# Altium schematic sheet BSPD_mod_0513.SchDoc (part 2 of 3)
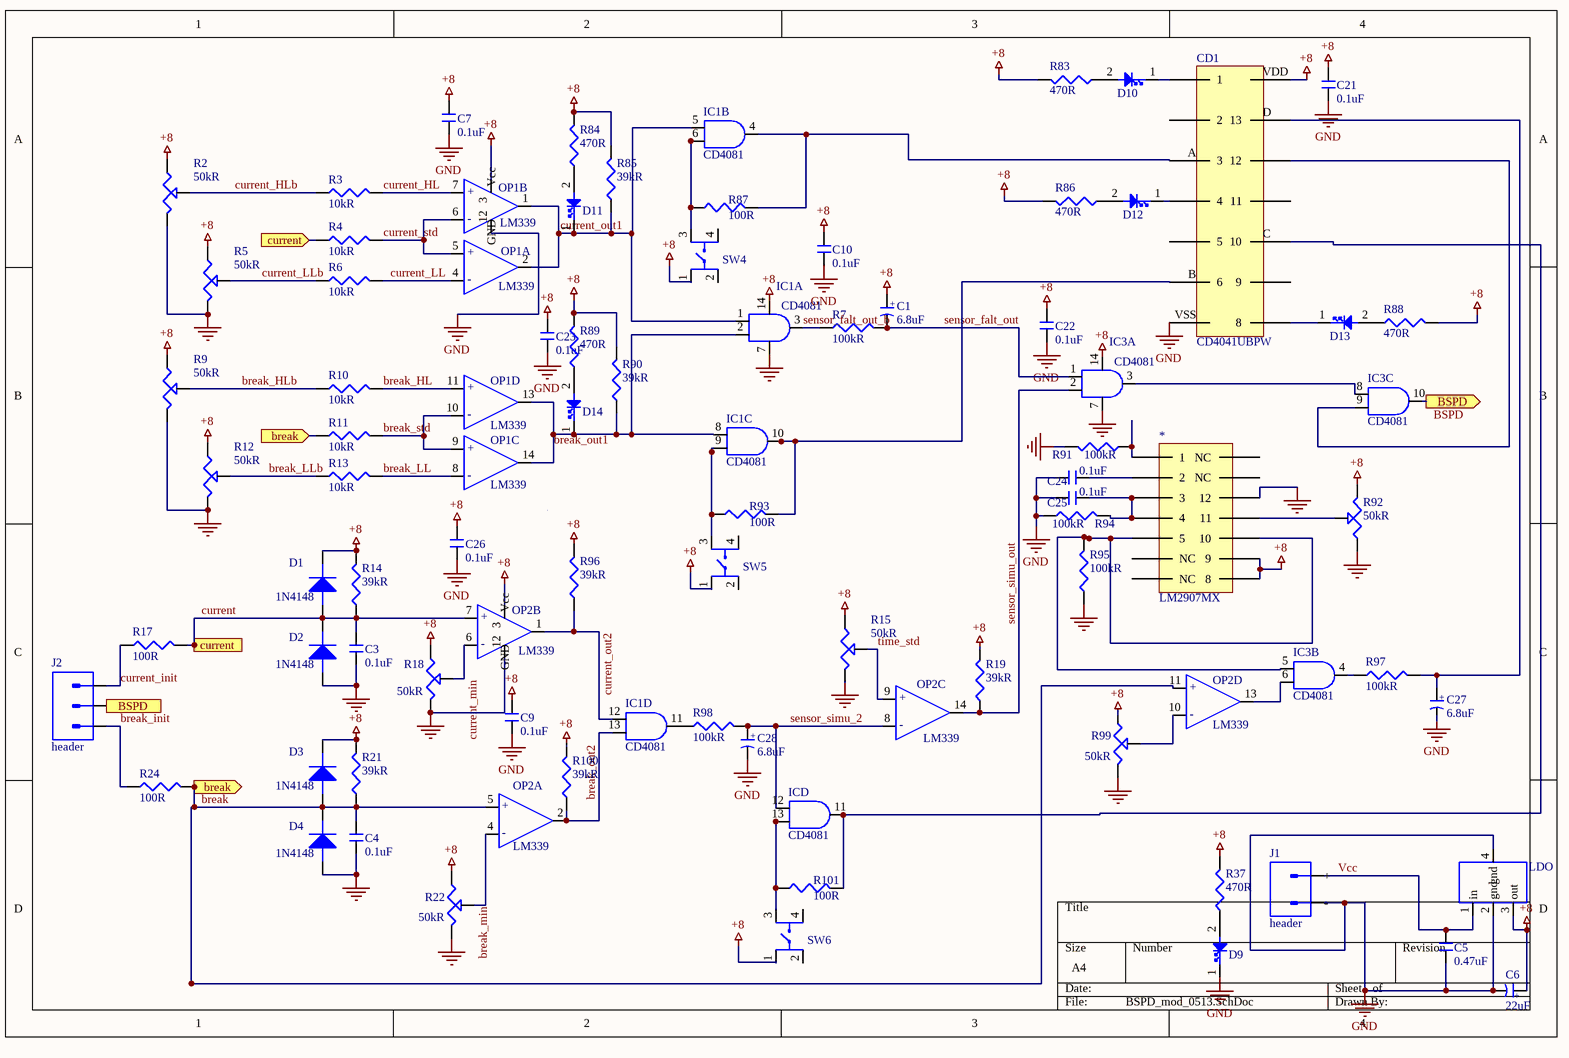
[diagram p1: BSPD_mod_0513.SchDoc]
## Library data of the parts
* = LM2907MX: FVC 14-Pin SOIC T/R; Manufacturer: TI National Semiconductor; Max Supply Voltage: 28V; Min Supply Voltage: 12V; Supplier 1: Digi-Key; Supplier Part Number 1: LM2907MXCT-ND; Manufacturer Part Number: LM2907MX; RoHS: No; Pricing 1: 1 = 2.84000 (USD); Case/Package: SOIC; Number of Pins: 14; Min Operating Temperature: -40°C; Max Operating Temperature: 85°C; Packaging: Tape and Reel; Package Quantity: 1; Radiation Hardening: No; Lead Free: Contains Lead; ComponentLink1URL: https://datasheet.ciiva.com/26887/lm2907mx-26887521.pdf?src-supplier=IIIC; ComponentLink1Description: https://datasheet.ciiva.com/26887/lm2907mx-26887521.pdf?src-supplier=IIIC; ComponentLink2URL: https://datasheet.ciiva.com/6598/lm2907-n-6598237.pdf?src-supplier=Digi-Key; ComponentLink2Description: https://datasheet.ciiva.com/6598/lm2907-n-6598237.pdf?src-supplier=Digi-Key; ComponentLink3URL: https://datasheet.ciiva.com/6598/lm2907-n-6598238.pdf?src-supplier=Digi-Key; ComponentLink3Description: https://datasheet.ciiva.com/6598/lm2907-n-6598238.pdf?src-supplier=Digi-Key; ComponentLink4URL: https://datasheet.ciiva.com/6598/lm2907-n-6598239.pdf?src-supplier=Digi-Key; ComponentLink4Description: https://datasheet.ciiva.com/6598/lm2907-n-6598239.pdf?src-supplier=Digi-Key
C1 C27 C28 = 6.8uF-TAJC685K050RNJ: Cap Tant Solid 6.8uF 50V C CASE 10% (6 X 3.2 X 2.6mm) Inward L SMD 6032-28 1 Ohm 125C T/R; Manufacturer: AVX; Dielectric Material: Tantalum; ESR (Equivalent Series Resistance): 1R; Leakage Current: 3.4uA; Polarity: Polar; Dissipation Factor: 6%; Supplier 1: Mouser; Supplier Part Number 1: 581-TAJC685K050RNJ; Manufacturer Part Number: TAJC685K050RNJ; Stock 1: 13768; Pricing 1: 1 = 1.27000, 10 = 0.96300, 100 = 0.75300, 500 = 0.49500, 1000 = 0.43600, 2500 = 0.42200 (USD); Mount: Surface Mount; Case/Package: Molded; Weight: 0.005291oz; Case Code (Metric): 6032; Case Code (Imperial): 2312; Min Operating Temperature: -55°C; Max Operating Temperature: 125°C; Capacitance: 6.8uF; Tolerance: 10%; Voltage Rating: 50V; Packaging: Tape and Reel; Package Quantity: 1; Termination: SMD/SMT; Voltage Rating (DC): 50V; Features: General Purpose; Length: 6mm; Height: 2.8mm; Width: 0.126inch; Height - Seated (Max): 0.11inch; Depth: 3.2mm; Radiation Hardening: No; REACH SVHC: No SVHC; Lead Free: Lead Free; ComponentLink1URL: https://datasheet.ciiva.com/267/taj-267945.pdf?src-supplier=Digi-Key; ComponentLink1Description: https://datasheet.ciiva.com/267/taj-267945.pdf?src-supplier=Digi-Key; ComponentLink2URL: https://datasheet.ciiva.com/267/taj-267946.pdf?src-supplier=Digi-Key; ComponentLink2Description: https://datasheet.ciiva.com/267/taj-267946.pdf?src-supplier=Digi-Key; ComponentLink3URL: https://datasheet.ciiva.com/267/taj-267947.pdf?src-supplier=Digi-Key; ComponentLink3Description: https://datasheet.ciiva.com/267/taj-267947.pdf?src-supplier=Digi-Key; ComponentLink4URL: https://datasheet.ciiva.com/12910/taj-27497-12910591.pdf?src-supplier=Mouser; ComponentLink4Description: https://datasheet.ciiva.com/12910/taj-27497-12910591.pdf?src-supplier=Mouser; ComponentLink5URL: https://datasheet.ciiva.com/17338/taj-17338791.pdf?src-supplier=Avnet+Europe; ComponentLink5Description: https://datasheet.ciiva.com/17338/taj-17338791.pdf?src-supplier=Avnet+Europe; ComponentLink6URL: http://datasheet.octopart.com/TAJC685K050RNJ-AVX-datasheet-50868559.pdf?src-supplier=AVX; ComponentLink6Description: http://datasheet.octopart.com/TAJC685K050RNJ-AVX-datasheet-50868559.pdf?src-supplier=AVX; ComponentLink7URL: http://datasheet.octopart.com/TAJC685K050RNJ-AVX-datasheet-5313859.pdf?src-supplier=Element14; ComponentLink7Description: http://datasheet.octopart.com/TAJC685K050RNJ-AVX-datasheet-5313859.pdf?src-supplier=Element14; ComponentLink8URL: http://datasheet.octopart.com/TAJC685K050RNJ-AVX-datasheet-78694144.pdf?src-supplier=Element14; ComponentLink8Description: http://datasheet.octopart.com/TAJC685K050RNJ-AVX-datasheet-78694144.pdf?src-supplier=Element14; ComponentLink9URL: http://datasheet.octopart.com/TAJC685K050RNJ-AVX-Interconnect---Elco-datasheet-8359467.pdf; ComponentLink9Description: http://datasheet.octopart.com/TAJC685K050RNJ-AVX-Interconnect---Elco-datasheet-8359467.pdf; ComponentLink10URL: http://datasheet.octopart.com/TAJC685K050RNJ-AVX-Interconnect---Elco-datasheet-8398506.pdf; ComponentLink10Description: http://datasheet.octopart.com/TAJC685K050RNJ-AVX-Interconnect---Elco-datasheet-8398506.pdf; ComponentLink11URL: http://datasheet.octopart.com/TAJC685K050RNJ-AVX-Interconnect---Elco-datasheet-12511273.pdf; ComponentLink11Description: http://datasheet.octopart.com/TAJC685K050RNJ-AVX-Interconnect---Elco-datasheet-12511273.pdf; ComponentLink12URL: http://datasheet.octopart.com/TAJC685K050RNJ-AVX-Interconnect---Elco-datasheet-5308206.pdf?src-supplier=Factory+Futures; ComponentLink12Description: http://datasheet.octopart.com/TAJC685K050RNJ-AVX-Interconnect---Elco-datasheet-5308206.pdf?src-supplier=Factory+Futures; ComponentLink13URL: http://datasheet.octopart.com/TAJC685K050RNJ-AVX-Interconnect---Elco-datasheet-5393561.pdf?src-supplier=Factory+Futures; ComponentLink13Description: http://datasheet.octopart.com/TAJC685K050RNJ-AVX-Interconnect---Elco-datasheet-5393561.pdf?src-supplier=Factory+Futures; ComponentLink14URL: http://datasheet.octopart.com/TAJC685K050RNJ-AVX-Interconnect---Elco-datasheet-5428838.pdf?src-supplier=Factory+Futures; ComponentLink14Description: http://datasheet.octopart.com/TAJC685K050RNJ-AVX-Interconnect---Elco-datasheet-5428838.pdf?src-supplier=Factory+Futures; ComponentLink15URL: http://datasheet.octopart.com/TAJC685K050RNJ-AVX-Interconnect---Elco-datasheet-8324253.pdf?src-supplier=Factory+Futures; ComponentLink15Description: http://datasheet.octopart.com/TAJC685K050RNJ-AVX-Interconnect---Elco-datasheet-8324253.pdf?src-supplier=Factory+Futures; ComponentLink16URL: http://datasheet.octopart.com/TAJC685K050RNJ-AVX-Interconnect---Elco-datasheet-8447299.pdf?src-supplier=Factory+Futures; ComponentLink16Description: http://datasheet.octopart.com/TAJC685K050RNJ-AVX-Interconnect---Elco-datasheet-8447299.pdf?src-supplier=Factory+Futures; ComponentLink17URL: http://datasheet.octopart.com/TAJC685K050RNJ-AVX-Interconnect---Elco-datasheet-8621976.pdf?src-supplier=Factory+Futures; ComponentLink17Description: http://datasheet.octopart.com/TAJC685K050RNJ-AVX-Interconnect---Elco-datasheet-8621976.pdf?src-supplier=Factory+Futures; ComponentLink18URL: http://datasheet.octopart.com/TAJC685K050RNJ-AVX-Interconnect---Elco-datasheet-8701730.pdf?src-supplier=Factory+Futures; ComponentLink18Description: http://datasheet.octopart.com/TAJC685K050RNJ-AVX-Interconnect---Elco-datasheet-8701730.pdf?src-supplier=Factory+Futures; ComponentLink19URL: http://datasheet.octopart.com/TAJC685K050RNJ-AVX-Interconnect---Elco-datasheet-8715220.pdf?src-supplier=Factory+Futures; ComponentLink19Description: http://datasheet.octopart.com/TAJC685K050RNJ-AVX-Interconnect---Elco-datasheet-8715220.pdf?src-supplier=Factory+Futures; ComponentLink20URL: http://datasheet.octopart.com/TAJC685K050RNJ-AVX-Interconnect---Elco-datasheet-8836325.pdf?src-supplier=Factory+Futures; ComponentLink20Description: http://datasheet.octopart.com/TAJC685K050RNJ-AVX-Interconnect---Elco-datasheet-8836325.pdf?src-supplier=Factory+Futures; ComponentLink21URL: http://datasheet.octopart.com/TAJC685K050RNJ-AVX-Interconnect---Elco-datasheet-8853265.pdf?src-supplier=Factory+Futures; ComponentLink21Description: http://datasheet.octopart.com/TAJC685K050RNJ-AVX-Interconnect---Elco-datasheet-8853265.pdf?src-supplier=Factory+Futures; ComponentLink22URL: http://datasheet.octopart.com/TAJC685K050RNJ-AVX-Interconnect---Elco-datasheet-8858887.pdf?src-supplier=Factory+Futures; ComponentLink22Description: http://datasheet.octopart.com/TAJC685K050RNJ-AVX-Interconnect---Elco-datasheet-8858887.pdf?src-supplier=Factory+Futures; ComponentLink23URL: http://datasheet.octopart.com/TAJC685K050RNJ-AVX-Interconnect---Elco-datasheet-8877386.pdf?src-supplier=Factory+Futures; ComponentLink23Description: http://datasheet.octopart.com/TAJC685K050RNJ-AVX-Interconnect---Elco-datasheet-8877386.pdf?src-supplier=Factory+Futures; ComponentLink24URL: http://datasheet.octopart.com/TAJC685K050RNJ-AVX-Interconnect---Elco-datasheet-10028080.pdf?src-supplier=Factory+Futures; ComponentLink24Description: http://datasheet.octopart.com/TAJC685K050RNJ-AVX-Interconnect---Elco-datasheet-10028080.pdf?src-supplier=Factory+Futures; ComponentLink25URL: http://datasheet.octopart.com/TAJC685K050RNJ-AVX-Interconnect---Elco-datasheet-10193294.pdf?src-supplier=Factory+Futures; ComponentLink25Description: http://datasheet.octopart.com/TAJC685K050RNJ-AVX-Interconnect---Elco-datasheet-10193294.pdf?src-supplier=Factory+Futures; ComponentLink26URL: http://datasheet.octopart.com/TAJC685K050RNJ-AVX-Interconnect---Elco-datasheet-10285639.pdf?src-supplier=Factory+Futures; ComponentLink26Description: http://datasheet.octopart.com/TAJC685K050RNJ-AVX-Interconnect---Elco-datasheet-10285639.pdf?src-supplier=Factory+Futures; ComponentLink27URL: http://datasheet.octopart.com/TAJC685K050RNJ-AVX-Interconnect---Elco-datasheet-10380087.pdf?src-supplier=Factory+Futures; ComponentLink27Description: http://datasheet.octopart.com/TAJC685K050RNJ-AVX-Interconnect---Elco-datasheet-10380087.pdf?src-supplier=Factory+Futures; ComponentLink28URL: http://datasheet.octopart.com/TAJC685K050RNJ-AVX-Interconnect---Elco-datasheet-10403705.pdf?src-supplier=Factory+Futures; ComponentLink28Description: http://datasheet.octopart.com/TAJC685K050RNJ-AVX-Interconnect---Elco-datasheet-10403705.pdf?src-supplier=Factory+Futures; ComponentLink29URL: http://datasheet.octopart.com/TAJC685K050RNJ-AVX-Interconnect---Elco-datasheet-10545425.pdf?src-supplier=Factory+Futures; ComponentLink29Description: http://datasheet.octopart.com/TAJC685K050RNJ-AVX-Interconnect---Elco-datasheet-10545425.pdf?src-supplier=Factory+Futures; ComponentLink30URL: http://datasheet.octopart.com/TAJC685K050RNJ-AVX-Interconnect---Elco-datasheet-10620092.pdf?src-supplier=Factory+Futures; ComponentLink30Description: http://datasheet.octopart.com/TAJC685K050RNJ-AVX-Interconnect---Elco-datasheet-10620092.pdf?src-supplier=Factory+Futures; ComponentLink31URL: http://datasheet.octopart.com/TAJC685K050RNJ-AVX-Interconnect---Elco-datasheet-10839255.pdf?src-supplier=Factory+Futures; ComponentLink31Description: http://datasheet.octopart.com/TAJC685K050RNJ-AVX-Interconnect---Elco-datasheet-10839255.pdf?src-supplier=Factory+Futures; ComponentLink32URL: http://datasheet.octopart.com/TAJC685K050RNJ-AVX-Interconnect---Elco-datasheet-10851837.pdf?src-supplier=Factory+Futures; ComponentLink32Description: http://datasheet.octopart.com/TAJC685K050RNJ-AVX-Interconnect---Elco-datasheet-10851837.pdf?src-supplier=Factory+Futures; ComponentLink33URL: http://datasheet.octopart.com/TAJC685K050RNJ-AVX-Interconnect---Elco-datasheet-10916590.pdf?src-supplier=Factory+Futures; ComponentLink33Description: http://datasheet.octopart.com/TAJC685K050RNJ-AVX-Interconnect---Elco-datasheet-10916590.pdf?src-supplier=Factory+Futures; ComponentLink34URL: http://datasheet.octopart.com/TAJC685K050RNJ-AVX-Interconnect---Elco-datasheet-11475269.pdf?src-supplier=Factory+Futures; ComponentLink34Description: http://datasheet.octopart.com/TAJC685K050RNJ-AVX-Interconnect---Elco-datasheet-11475269.pdf?src-supplier=Factory+Futures; ComponentLink35URL: http://datasheet.octopart.com/TAJC685K050RNJ-AVX-datasheet-48507738.pdf?src-supplier=Future+Electronics; ComponentLink35Description: http://datasheet.octopart.com/TAJC685K050RNJ-AVX-datasheet-48507738.pdf?src-supplier=Future+Electronics; ComponentLink36URL: http://datasheet.octopart.com/TAJC685K050RNJ-AVX-datasheet-66442782.pdf?src-supplier=Newark; ComponentLink36Description: http://datasheet.octopart.com/TAJC685K050RNJ-AVX-datasheet-66442782.pdf?src-supplier=Newark; ComponentLink37URL: http://datasheet.octopart.com/TAJC685K050RNJ-AVX-datasheet-62304617.pdf?src-supplier=Farnell; ComponentLink37Description: http://datasheet.octopart.com/TAJC685K050RNJ-AVX-datasheet-62304617.pdf?src-supplier=Farnell; ComponentLink38URL: http://datasheet.octopart.com/TAJ-Series---Standard-Tantalum-AVX-datasheet-family-88.pdf; ComponentLink38Description: http://datasheet.octopart.com/TAJ-Series---Standard-Tantalum-AVX-datasheet-family-88.pdf
C3 C4 C7 C9 C10 C21-C26 = 0.1uF-C0603X104K5RAC3316: Cap Ceramic 0.1uF 50V X7R 10% Pad SMD 0603 Flexible Termination 125C Automotive; Manufacturer: KEMET; Supplier 1: Mouser; Supplier Part Number 1: 80-C0603X104K5R3316; Manufacturer Part Number: C0603X104K5RAC3316; Stock 1: 9731; Pricing 1: 1 = 0.19000, 10 = 0.12700, 100 = 0.06400, 500 = 0.04400, 1000 = 0.03800, 4000 = 0.03700 (USD); ComponentLink1URL: http://datasheet.octopart.com/C0603X104K5RAC3316-KEMET-datasheet-136663908.pdf?src-supplier=Allied+Electronics; ComponentLink1Description: http://datasheet.octopart.com/C0603X104K5RAC3316-KEMET-datasheet-136663908.pdf?src-supplier=Allied+Electronics
C5 = 0.47uF-C0805C474K3REC7210: Cap Cer 0805 470NF 25V X7R 10%; Manufacturer: KEMET; Supplier 1: Mouser; Manufacturer Part Number: C0805C474K3REC7210; Stock 1: 9935; Pricing 1: 1 = 0.30000, 10 = 0.14000, 100 = 0.09000, 500 = 0.08000, 1000 = 0.07000, 2000 = 0.06000 (USD); ComponentLink1URL: https://api.kemet.com/component-edge/download/datasheet/C0805C474K3REC7210.pdf?src-supplier=Digi-Key; ComponentLink1Description: https://api.kemet.com/component-edge/download/datasheet/C0805C474K3REC7210.pdf?src-supplier=Digi-Key; Supplier Part Number 1: 80-C0805C474K3RECLR
C6 = 22uF-GRM21BR61E226ME44L: 0805 22 uF 25 V ±20% Tolerance X5R SMT Multilayer Ceramic Capacitor; Manufacturer: Murata; Voltage Rating: 25V; Supplier 1: Mouser; Manufacturer Part Number: GRM21BR61E226ME44L; Stock 1: 455135; Pricing 1: 1 = 0.49000, 10 = 0.34800, 100 = 0.22900, 250 = 0.22900, 500 = 0.16900, 1000 = 0.14400, 3000 = 0.11800, 6000 = 0.11000, 9000 = 0.10600 (USD); Mount: Surface Mount; Case/Package: 0805; Weight: 0.000335oz; Case Code (Metric): 2012; Case Code (Imperial): 0805; Material: Ceramic; Min Operating Temperature: -55°C; Max Operating Temperature: 85°C; Capacitance: 22uF; Tolerance: 20%; Packaging: Tape and Reel; Dielectric: X5R; Voltage: 25V; Termination: SMD/SMT; Composition: Ceramic; Voltage Rating (DC): 25V; Package Quantity: 3000; Length: 2mm; Height: 1.25mm; Width: 1.25mm; Thickness: 0.057inch; Depth: 1.25mm; REACH SVHC: No SVHC; Lead Free: Lead Free; ComponentLink1URL: https://datasheet.ciiva.com/22787/1747471-22787265.pdf?src-supplier=Farnell; ComponentLink1Description: https://datasheet.ciiva.com/22787/1747471-22787265.pdf?src-supplier=Farnell; ComponentLink2URL: https://datasheet.ciiva.com/7719/1747471-7719095.pdf?src-supplier=Element14; ComponentLink2Description: https://datasheet.ciiva.com/7719/1747471-7719095.pdf?src-supplier=Element14; ComponentLink3URL: https://datasheet.ciiva.com/28584/1747471-28584199.pdf?src-supplier=Element14; ComponentLink3Description: https://datasheet.ciiva.com/28584/1747471-28584199.pdf?src-supplier=Element14; ComponentLink4URL: http://datasheet.octopart.com/GRM21BR61E226ME44L-Murata-datasheet-62317286.pdf?src-supplier=Element14; ComponentLink4Description: http://datasheet.octopart.com/GRM21BR61E226ME44L-Murata-datasheet-62317286.pdf?src-supplier=Element14; ComponentLink5URL: http://datasheet.octopart.com/GRM21BR61E226ME44L-Murata-datasheet-8817987.pdf?src-supplier=Newark; ComponentLink5Description: http://datasheet.octopart.com/GRM21BR61E226ME44L-Murata-datasheet-8817987.pdf?src-supplier=Newark; ComponentLink6URL: http://datasheet.octopart.com/GRM21BR61E226ME44L-Murata-datasheet-14397511.pdf?src-supplier=Future+Electronics; ComponentLink6Description: http://datasheet.octopart.com/GRM21BR61E226ME44L-Murata-datasheet-14397511.pdf?src-supplier=Future+Electronics; ComponentLink7URL: http://datasheet.octopart.com/GRM21BR61E226ME44L-Murata-datasheet-17853151.pdf?src-supplier=Element14; ComponentLink7Description: http://datasheet.octopart.com/GRM21BR61E226ME44L-Murata-datasheet-17853151.pdf?src-supplier=Element14; ComponentLink8URL: http://datasheet.octopart.com/GRM21BR61E226ME44L-Murata-datasheet-22122223.pdf?src-supplier=Future+Electronics; ComponentLink8Description: http://datasheet.octopart.com/GRM21BR61E226ME44L-Murata-datasheet-22122223.pdf?src-supplier=Future+Electronics; ComponentLink9URL: http://datasheet.octopart.com/GRM21BR61E226ME44L-Murata-datasheet-59876780.pdf?src-supplier=TME; ComponentLink9Description: http://datasheet.octopart.com/GRM21BR61E226ME44L-Murata-datasheet-59876780.pdf?src-supplier=TME; ComponentLink10URL: http://datasheet.octopart.com/GRM21BR61E226ME44L-Murata-datasheet-8819587.pdf; ComponentLink10Description: http://datasheet.octopart.com/GRM21BR61E226ME44L-Murata-datasheet-8819587.pdf; ComponentLink11URL: http://datasheet.octopart.com/GRM21BR61E226ME44L-Murata-datasheet-10025737.pdf; ComponentLink11Description: http://datasheet.octopart.com/GRM21BR61E226ME44L-Murata-datasheet-10025737.pdf; ComponentLink12URL: http://datasheet.octopart.com/GRM21BR61E226ME44L-Murata-datasheet-11978611.pdf; ComponentLink12Description: http://datasheet.octopart.com/GRM21BR61E226ME44L-Murata-datasheet-11978611.pdf; ComponentLink13URL: http://datasheet.octopart.com/GRM21BR61E226ME44L-Murata-datasheet-12510076.pdf; ComponentLink13Description: http://datasheet.octopart.com/GRM21BR61E226ME44L-Murata-datasheet-12510076.pdf; ComponentLink14URL: http://datasheet.octopart.com/GRM21BR61E226ME44L-Murata-datasheet-12515295.pdf; ComponentLink14Description: http://datasheet.octopart.com/GRM21BR61E226ME44L-Murata-datasheet-12515295.pdf; Supplier Part Number 1: 81-GRM21BR61E226ME4L
CD1 = CD4041UBPW: Buffer 4-CH Inverting/Non-Inverting Push-Pull CMOS 14-Pin TSSOP Tube; Manufacturer: Texas Instruments; Max Supply Voltage: 18V; Min Supply Voltage: 3V; Propagation Delay: 50ns; Number of Elements: 4; Low Level Output Current: 24mA; Number of Output Lines: 8; Number of Bits per Element: 1; High Level Output Current: -24mA; Quiescent Current: 20uA; Turn-On Delay Time: 120ns; Max Power Dissipation: 100mW; Supplier 1: Digi-Key; Supplier Part Number 1: CD4041UBPW-ND; Manufacturer Part Number: CD4041UBPW; Stock 1: 700; Pricing 1: 1 = 1.29000, 10 = 1.15600, 25 = 1.09760, 100 = 0.90160, 250 = 0.84280, 500 = 0.74480, 1000 = 0.58800, 2500 = 0.54880, 5000 = 0.52136 (USD); Mount: Surface Mount; Case/Package: TSSOP; Number of Pins: 14; Contact Plating: Gold; Min Operating Temperature: -55°C; Max Operating Temperature: 125°C; Packaging: Rail/Tube; Logic Function: Buffer; Package Quantity: 90; Number of Channels: 4; Number of Inputs: 4; Number of Outputs: 4; Number of Input Lines: 4; Polarity: Non-Inverting; Number of Bits: 4; Termination: SMD/SMT; Lead Free: Lead Free; REACH SVHC: No SVHC; ComponentLink1URL: https://datasheet.ciiva.com/1506/1762971-1506275.pdf?src-supplier=Element14; ComponentLink1Description: https://datasheet.ciiva.com/1506/1762971-1506275.pdf?src-supplier=Element14; ComponentLink2URL: https://datasheet.ciiva.com/46618/1836516-46618790.pdf?src-supplier=Newark; ComponentLink2Description: https://datasheet.ciiva.com/46618/1836516-46618790.pdf?src-supplier=Newark; ComponentLink3URL: https://datasheet.ciiva.com/1842/cd4041ub-1842824.pdf?src-supplier=Digi-Key; ComponentLink3Description: https://datasheet.ciiva.com/1842/cd4041ub-1842824.pdf?src-supplier=Digi-Key; ComponentLink4URL: https://octopart.com/click/track?ai=10049&ct=datasheets&sig=04d6427&at=physicalpart&sid=370&ppid=7097409&hlid=29930956&src-supplier=TI+store; ComponentLink4Description: https://octopart.com/click/track?ai=10049&ct=datasheets&sig=04d6427&at=physicalpart&sid=370&ppid=7097409&hlid=29930956&src-supplier=TI+store; ComponentLink5URL: http://datasheet.octopart.com/CD4041UBPW-Texas-Instruments-datasheet-10255163.pdf?src-supplier=Arrow+Electronics; ComponentLink5Description: http://datasheet.octopart.com/CD4041UBPW-Texas-Instruments-datasheet-10255163.pdf?src-supplier=Arrow+Electronics; ComponentLink6URL: http://datasheet.octopart.com/CD4041UBPW-Texas-Instruments-datasheet-27908145.pdf?src-supplier=TI+store; ComponentLink6Description: http://datasheet.octopart.com/CD4041UBPW-Texas-Instruments-datasheet-27908145.pdf?src-supplier=TI+store; ComponentLink7URL: http://datasheet.octopart.com/CD4041UBPW-Texas-Instruments-datasheet-149741.pdf?src-supplier=TI+store; ComponentLink7Description: http://datasheet.octopart.com/CD4041UBPW-Texas-Instruments-datasheet-149741.pdf?src-supplier=TI+store; ComponentLink8URL: http://datasheet.octopart.com/CD4041UBPW-Texas-Instruments-datasheet-10253518.pdf?src-supplier=TI+store; ComponentLink8Description: http://datasheet.octopart.com/CD4041UBPW-Texas-Instruments-datasheet-10253518.pdf?src-supplier=TI+store; ComponentLink9URL: http://sigma.octopart.com/49249819/technical_drawing/Texas-Instruments-CD4041UBPW.pdf?src-supplier=TI+store; ComponentLink9Description: http://sigma.octopart.com/49249819/technical_drawing/Texas-Instruments-CD4041UBPW.pdf?src-supplier=TI+store; ComponentLink10URL: http://datasheet.octopart.com/CD4041UBPW-Texas-Instruments-datasheet-8377696.pdf?src-supplier=Newark; ComponentLink10Description: http://datasheet.octopart.com/CD4041UBPW-Texas-Instruments-datasheet-8377696.pdf?src-supplier=Newark; ComponentLink11URL: http://datasheet.octopart.com/CD4041UBPW-Texas-Instruments-datasheet-654559.pdf?src-supplier=Newark; ComponentLink11Description: http://datasheet.octopart.com/CD4041UBPW-Texas-Instruments-datasheet-654559.pdf?src-supplier=Newark; ComponentLink12URL: http://datasheet.octopart.com/CD4041UBPW-Texas-Instruments-datasheet-8816533.pdf?src-supplier=Newark; ComponentLink12Description: http://datasheet.octopart.com/CD4041UBPW-Texas-Instruments-datasheet-8816533.pdf?src-supplier=Newark; ComponentLink13URL: http://datasheet.octopart.com/CD4041UBPW-Texas-Instruments-datasheet-11538150.pdf?src-supplier=Element14; ComponentLink13Description: http://datasheet.octopart.com/CD4041UBPW-Texas-Instruments-datasheet-11538150.pdf?src-supplier=Element14; ComponentLink14URL: http://datasheet.octopart.com/CD4041UBPW-Texas-Instruments-datasheet-21076600.pdf?src-supplier=Element14; ComponentLink14Description: http://datasheet.octopart.com/CD4041UBPW-Texas-Instruments-datasheet-21076600.pdf?src-supplier=Element14; ComponentLink15URL: http://datasheet.octopart.com/CD4041UBPW-Texas-Instruments-datasheet-47642687.pdf?src-supplier=Newark; ComponentLink15Description: http://datasheet.octopart.com/CD4041UBPW-Texas-Instruments-datasheet-47642687.pdf?src-supplier=Newark; ComponentLink16URL: http://datasheet.octopart.com/CD4041UBPW-Texas-Instruments-datasheet-102487265.pdf?src-supplier=Newark; ComponentLink16Description: http://datasheet.octopart.com/CD4041UBPW-Texas-Instruments-datasheet-102487265.pdf?src-supplier=Newark; Category: buffer
D1-D4 = 1N4148W-TP: 1N4148W Series 100 V 150 mA 4 ns SMT High Speed Switching Diode - SOD-123; Manufacturer: MCC; Max Surge Current: 2A; Forward Voltage: 1V; Forward Current: 150mA; Recovery Time: 4ns; Max Reverse Leakage Current: 5uA; Max Repetitive Reverse Voltage (Vrrm): 100V; Power Dissipation: 400mW; Max Forward Surge Current (Ifsm): 1A; Element Configuration: Single; Polarity: Standard; Capacitance: 4pF; Supplier 1: Digi-Key; Supplier Part Number 1: 1N4148WTPMSCT-ND; Manufacturer Part Number: 1N4148W-TP; Stock 1: 726390; Pricing 1: 1 = 0.10000, 10 = 0.08100, 100 = 0.03400, 500 = 0.02670, 1000 = 0.01854 (USD); Mount: Surface Mount; Number of Pins: 2; Min Operating Temperature: -65°C; Max Operating Temperature: 150°C; Packaging: Tape and Reel; Package Quantity: 3000; Average Rectified Current: 150mA; Reverse Recovery Time: 4ns; Peak Non-Repetitive Surge Current: 2A; Voltage Rating (DC): 100V; Current Rating: 150mA; Output Current: 150mA; Max Reverse Voltage (DC): 100V; Length: 2.85mm; Height: 1.2mm; Width: 1.8mm; Radiation Hardening: No; REACH SVHC: Unknown; Lead Free: Lead Free; ComponentLink1URL: https://datasheet.ciiva.com/1243/1684829-1243908.pdf?src-supplier=Newark; ComponentLink1Description: https://datasheet.ciiva.com/1243/1684829-1243908.pdf?src-supplier=Newark; ComponentLink2URL: https://datasheet.ciiva.com/16836/1n4148wsod123-16836277.pdf?src-supplier=Future+Electronics; ComponentLink2Description: https://datasheet.ciiva.com/16836/1n4148wsod123-16836277.pdf?src-supplier=Future+Electronics; ComponentLink3URL: https://datasheet.ciiva.com/4435/1n4148wsod123-48460-4435223.pdf?src-supplier=Mouser; ComponentLink3Description: https://datasheet.ciiva.com/4435/1n4148wsod123-48460-4435223.pdf?src-supplier=Mouser; ComponentLink4URL: https://datasheet.ciiva.com/14557/70055519-14557767.pdf?src-supplier=Allied+Electronics; ComponentLink4Description: https://datasheet.ciiva.com/14557/70055519-14557767.pdf?src-supplier=Allied+Electronics; ComponentLink5URL: https://datasheet.ciiva.com/911/1n4148wsod123-911676.pdf?src-supplier=Digi-Key; ComponentLink5Description: https://datasheet.ciiva.com/911/1n4148wsod123-911676.pdf?src-supplier=Digi-Key; ComponentLink6URL: https://datasheet.ciiva.com/7622/1684829-7622556.pdf?src-supplier=Element14; ComponentLink6Description: https://datasheet.ciiva.com/7622/1684829-7622556.pdf?src-supplier=Element14; ComponentLink7URL: https://datasheet.ciiva.com/911/1n4148wsod123-911677.pdf?src-supplier=Digi-Key; ComponentLink7Description: https://datasheet.ciiva.com/911/1n4148wsod123-911677.pdf?src-supplier=Digi-Key; ComponentLink8URL: https://datasheet.ciiva.com/911/1n4148wsod123-911678.pdf?src-supplier=Digi-Key; ComponentLink8Description: https://datasheet.ciiva.com/911/1n4148wsod123-911678.pdf?src-supplier=Digi-Key; ComponentLink9URL: https://datasheet.ciiva.com/22747/1684829-22747439.pdf?src-supplier=Element14; ComponentLink9Description: https://datasheet.ciiva.com/22747/1684829-22747439.pdf?src-supplier=Element14; ComponentLink10URL: http://datasheet.octopart.com/1N4148W-TP-Micro-Commercial-datasheet-60845.pdf?src-supplier=Element14; ComponentLink10Description: http://datasheet.octopart.com/1N4148W-TP-Micro-Commercial-datasheet-60845.pdf?src-supplier=Element14; ComponentLink11URL: http://datasheet.octopart.com/1N4148W-TP-MCC-datasheet-8327246.pdf?src-supplier=Future+Electronics; ComponentLink11Description: http://datasheet.octopart.com/1N4148W-TP-MCC-datasheet-8327246.pdf?src-supplier=Future+Electronics; ComponentLink12URL: http://datasheet.octopart.com/1N4148W-TP-MCC-datasheet-124568.pdf?src-supplier=Future+Electronics; ComponentLink12Description: http://datasheet.octopart.com/1N4148W-TP-MCC-datasheet-124568.pdf?src-supplier=Future+Electronics; ComponentLink13URL: http://datasheet.octopart.com/1N4148W-TP-MCC-datasheet-10003094.pdf?src-supplier=Allied+Electronics; ComponentLink13Description: http://datasheet.octopart.com/1N4148W-TP-MCC-datasheet-10003094.pdf?src-supplier=Allied+Electronics; ComponentLink14URL: http://datasheet.octopart.com/1N4148W-TP-Micro-Commercial-datasheet-11773887.pdf?src-supplier=Arrow; ComponentLink14Description: http://datasheet.octopart.com/1N4148W-TP-Micro-Commercial-datasheet-11773887.pdf?src-supplier=Arrow; ComponentLink15URL: http://datasheet.octopart.com/1N4148W-TP-Micro-Commercial-datasheet-13551187.pdf?src-supplier=Future+Electronics; ComponentLink15Description: http://datasheet.octopart.com/1N4148W-TP-Micro-Commercial-datasheet-13551187.pdf?src-supplier=Future+Electronics; ComponentLink16URL: http://datasheet.octopart.com/1N4148W-TP-MCC-datasheet-133511570.pdf?src-supplier=Future+Electronics; ComponentLink16Description: http://datasheet.octopart.com/1N4148W-TP-MCC-datasheet-133511570.pdf?src-supplier=Future+Electronics; ComponentLink17URL: http://datasheet.octopart.com/1N4148W-TP-MCC-datasheet-134792309.pdf?src-supplier=TME; ComponentLink17Description: http://datasheet.octopart.com/1N4148W-TP-MCC-datasheet-134792309.pdf?src-supplier=TME; Supplier 2: Mouser; Supplier Part Number 2: 833-1N4148W-TP
D9-D14 = led-150080RS75000: On a Reel of 4000, 2 V Red LED 2012 (0805) SMD, Wurth Elektronik WL-SMCW 150080RS75000; Manufacturer: Würth Elektronik; Luminous Intensity: 150mcd; Viewing Angle: 140°; Forward Voltage: 2V; Wavelength: 625nm; Lens Style: Clear; Forward Current: 30mA; Test Current: 20mA; Supplier 1: Mouser; Supplier Part Number 1: 710-150080RS75000; Manufacturer Part Number: 150080RS75000; Stock 1: 24117; Pricing 1: 1 = 0.18000, 10 = 0.17500, 25 = 0.17400, 50 = 0.16200, 100 = 0.13900, 250 = 0.12300 (USD); Mount: Surface Mount; Case/Package: 0805; Color: Red; Case Code (Metric): 2012; Case Code (Imperial): 0805; Min Operating Temperature: -40°C; Max Operating Temperature: 85°C; Package Quantity: 4000; Packaging: Tape and Reel; Dominant Wavelength: 625nm; Length: 2mm; Height: 0.7mm; Width: 1.25mm; REACH SVHC: Unknown; ComponentLink1URL: https://datasheet.ciiva.com/22656/150080rs75000-22656961.pdf?src-supplier=Element14; ComponentLink1Description: https://datasheet.ciiva.com/22656/150080rs75000-22656961.pdf?src-supplier=Element14; ComponentLink2URL: https://datasheet.ciiva.com/29279/759435-da-01-en-chipled-0805-w-kl-rot-150080rs75000-29279032.pdf?src-supplier=Conrad; ComponentLink2Description: https://datasheet.ciiva.com/29279/759435-da-01-en-chipled-0805-w-kl-rot-150080rs75000-29279032.pdf?src-supplier=Conrad; ComponentLink3URL: http://datasheet.octopart.com/150080RS75000-W%C3%BCrth-Elektronik-datasheet-15983792.pdf?src-supplier=Element14; ComponentLink3Description: http://datasheet.octopart.com/150080RS75000-W%C3%BCrth-Elektronik-datasheet-15983792.pdf?src-supplier=Element14; ComponentLink4URL: http://datasheet.octopart.com/150080RS75000-W%C3%BCrth-Elektronik-datasheet-41196443.pdf?src-supplier=Newark; ComponentLink4Description: http://datasheet.octopart.com/150080RS75000-W%C3%BCrth-Elektronik-datasheet-41196443.pdf?src-supplier=Newark
IC IC1 IC3 = CD4081BM: In a Tube of 50, Texas Instruments CD4081BM, Quad 2-Input AND Logic Gate, 14-Pin SOIC; Min Supply Voltage: 3V; Max Supply Voltage: 18V; Number of Elements: 4; Number of Outputs: 1; Quiescent Current: 5uA; High Level Output Current: -4.2mA; Low Level Output Current: 4.2mA; Output Current: 6.8mA; Number of Inputs: 2; Propagation Delay: 90ns; Turn-On Delay Time: 12ns; Schmitt Trigger Input: No; Input Capacitance: 5pF; Power Dissipation: 500mW; Supplier 1: Mouser; Supplier Part Number 1: 595-CD4081BM; Manufacturer: Texas Instruments; Manufacturer Part Number: CD4081BM; Stock 1: 2050; Pricing 1: 1 = 0.52000, 10 = 0.43300, 100 = 0.26300, 1000 = 0.20300, 2500 = 0.17300, 10000 = 0.16100 (USD); Mount: Surface Mount; Case/Package: SOIC; Number of Pins: 14; Weight: 0.004564oz; Contact Plating: Gold; Min Operating Temperature: -55°C; Max Operating Temperature: 125°C; Logic Function: AND; Packaging: Rail/Tube; Package Quantity: 50; Number of Gates: 4; Number of Circuits: 4; Number of Input Lines: 2; Number of Output Lines: 1; Number of Bits: 4; Length: 8.65mm; Height: 1.58mm; Width: 3.91mm; Radiation Hardening: No; Lead Free: Lead Free; REACH SVHC: No SVHC; ComponentLink1URL: https://datasheet.ciiva.com/1626/cd4081b-1626210.pdf?src-supplier=Newark; ComponentLink1Description: https://datasheet.ciiva.com/1626/cd4081b-1626210.pdf?src-supplier=Newark; ComponentLink2URL: https://datasheet.ciiva.com/15090/getdatasheetpartid-83085-15090610.pdf?src-supplier=Verical; ComponentLink2Description: https://datasheet.ciiva.com/15090/getdatasheetpartid-83085-15090610.pdf?src-supplier=Verical; ComponentLink3URL: https://datasheet.ciiva.com/26865/cd4081bm-26865364.pdf?src-supplier=IIIC; ComponentLink3Description: https://datasheet.ciiva.com/26865/cd4081bm-26865364.pdf?src-supplier=IIIC; ComponentLink4URL: https://datasheet.ciiva.com/41455/001015529-da-01-en-ic-2-in-and-gate-qu-cd4081bm-soic-14-tid-41455446.pdf?src-supplier=Conrad; ComponentLink4Description: https://datasheet.ciiva.com/41455/001015529-da-01-en-ic-2-in-and-gate-qu-cd4081bm-soic-14-tid-41455446.pdf?src-supplier=Conrad; ComponentLink5URL: https://datasheet.ciiva.com/1866/cd4073b-1866564.pdf?src-supplier=Digi-Key; ComponentLink5Description: https://datasheet.ciiva.com/1866/cd4073b-1866564.pdf?src-supplier=Digi-Key; ComponentLink6URL: https://datasheet.ciiva.com/7949/1833366-7949020.pdf?src-supplier=Element14; ComponentLink6Description: https://datasheet.ciiva.com/7949/1833366-7949020.pdf?src-supplier=Element14; ComponentLink7URL: https://octopart.com/click/track?ai=8629&ct=datasheets&sig=02680e7&at=physicalpart&sid=370&ppid=42573&hlid=24875867&src-supplier=TI+store; ComponentLink7Description: https://octopart.com/click/track?ai=8629&ct=datasheets&sig=02680e7&at=physicalpart&sid=370&ppid=42573&hlid=24875867&src-supplier=TI+store; ComponentLink8URL: http://datasheet.octopart.com/CD4081BM-Texas-Instruments-datasheet-151253.pdf?src-supplier=TI+store; ComponentLink8Description: http://datasheet.octopart.com/CD4081BM-Texas-Instruments-datasheet-151253.pdf?src-supplier=TI+store; ComponentLink9URL: http://datasheet.octopart.com/CD4081BM-Texas-Instruments-datasheet-10253518.pdf?src-supplier=TI+store; ComponentLink9Description: http://datasheet.octopart.com/CD4081BM-Texas-Instruments-datasheet-10253518.pdf?src-supplier=TI+store; ComponentLink10URL: http://datasheet.octopart.com/CD4081BM-Texas-Instruments-datasheet-10253444.pdf?src-supplier=TI+store; ComponentLink10Description: http://datasheet.octopart.com/CD4081BM-Texas-Instruments-datasheet-10253444.pdf?src-supplier=TI+store; ComponentLink11URL: http://datasheet.octopart.com/CD4081BM-Texas-Instruments-datasheet-10794629.pdf?src-supplier=TI+store; ComponentLink11Description: http://datasheet.octopart.com/CD4081BM-Texas-Instruments-datasheet-10794629.pdf?src-supplier=TI+store; ComponentLink12URL: http://sigma.octopart.com/49249646/technical_drawing/Texas-Instruments-CD4081BM.pdf?src-supplier=TI+store; ComponentLink12Description: http://sigma.octopart.com/49249646/technical_drawing/Texas-Instruments-CD4081BM.pdf?src-supplier=TI+store; ComponentLink13URL: http://datasheet.octopart.com/CD4081BM-Texas-Instruments-datasheet-47642733.pdf?src-supplier=Farnell; ComponentLink13Description: http://datasheet.octopart.com/CD4081BM-Texas-Instruments-datasheet-47642733.pdf?src-supplier=Farnell; ComponentLink14URL: http://datasheet.octopart.com/CD4081BM-Texas-Instruments-datasheet-5313817.pdf?src-supplier=Newark; ComponentLink14Description: http://datasheet.octopart.com/CD4081BM-Texas-Instruments-datasheet-5313817.pdf?src-supplier=Newark; ComponentLink15URL: http://datasheet.octopart.com/CD4081BM-Texas-Instruments-datasheet-8372246.pdf?src-supplier=Newark; ComponentLink15Description: http://datasheet.octopart.com/CD4081BM-Texas-Instruments-datasheet-8372246.pdf?src-supplier=Newark; ComponentLink16URL: http://datasheet.octopart.com/CD4081BM-Texas-Instruments-datasheet-32637.pdf?src-supplier=Newark; ComponentLink16Description: http://datasheet.octopart.com/CD4081BM-Texas-Instruments-datasheet-32637.pdf?src-supplier=Newark; ComponentLink17URL: http://datasheet.octopart.com/CD4081BM-Texas-Instruments-datasheet-5254.pdf?src-supplier=Allied+Electronics; ComponentLink17Description: http://datasheet.octopart.com/CD4081BM-Texas-Instruments-datasheet-5254.pdf?src-supplier=Allied+Electronics; ComponentLink18URL: http://datasheet.octopart.com/CD4081BM-Texas-Instruments-datasheet-111545.pdf?src-supplier=Sierra+IC; ComponentLink18Description: http://datasheet.octopart.com/CD4081BM-Texas-Instruments-datasheet-111545.pdf?src-supplier=Sierra+IC; ComponentLink19URL: http://datasheet.octopart.com/CD4081BM-Texas-Instruments-datasheet-7596796.pdf?src-supplier=Jameco; ComponentLink19Description: http://datasheet.octopart.com/CD4081BM-Texas-Instruments-datasheet-7596796.pdf?src-supplier=Jameco; ComponentLink20URL: http://datasheet.octopart.com/CD4081BM-Texas-Instruments-datasheet-7626019.pdf?src-supplier=Farnell; ComponentLink20Description: http://datasheet.octopart.com/CD4081BM-Texas-Instruments-datasheet-7626019.pdf?src-supplier=Farnell; ComponentLink21URL: http://datasheet.octopart.com/CD4081BM-Texas-Instruments-datasheet-7628878.pdf?src-supplier=Farnell; ComponentLink21Description: http://datasheet.octopart.com/CD4081BM-Texas-Instruments-datasheet-7628878.pdf?src-supplier=Farnell; ComponentLink22URL: http://datasheet.octopart.com/CD4081BM-Texas-Instruments-datasheet-7547189.pdf?src-supplier=Farnell; ComponentLink22Description: http://datasheet.octopart.com/CD4081BM-Texas-Instruments-datasheet-7547189.pdf?src-supplier=Farnell; ComponentLink23URL: http://datasheet.octopart.com/CD4081BM-Texas-Instruments-datasheet-5327680.pdf?src-supplier=Farnell; ComponentLink23Description: http://datasheet.octopart.com/CD4081BM-Texas-Instruments-datasheet-5327680.pdf?src-supplier=Farnell; ComponentLink24URL: http://datasheet.octopart.com/CD4081BM-Texas-Instruments-datasheet-8703573.pdf?src-supplier=Farnell; ComponentLink24Description: http://datasheet.octopart.com/CD4081BM-Texas-Instruments-datasheet-8703573.pdf?src-supplier=Farnell; ComponentLink25URL: http://datasheet.octopart.com/CD4081BM-Texas-Instruments-datasheet-604431.pdf?src-supplier=Farnell; ComponentLink25Description: http://datasheet.octopart.com/CD4081BM-Texas-Instruments-datasheet-604431.pdf?src-supplier=Farnell; ComponentLink26URL: http://datasheet.octopart.com/CD4081BM-Texas-Instruments-datasheet-14147925.pdf?src-supplier=IIIC; ComponentLink26Description: http://datasheet.octopart.com/CD4081BM-Texas-Instruments-datasheet-14147925.pdf?src-supplier=IIIC; ComponentLink27URL: http://datasheet.octopart.com/CD4081BM-Texas-Instruments-datasheet-10549843.pdf?src-supplier=Factory+Futures; ComponentLink27Description: http://datasheet.octopart.com/CD4081BM-Texas-Instruments-datasheet-10549843.pdf?src-supplier=Factory+Futures; ComponentLink28URL: http://datasheet.octopart.com/CD4081BM-Texas-Instruments-datasheet-27379352.pdf?src-supplier=Newark; ComponentLink28Description: http://datasheet.octopart.com/CD4081BM-Texas-Instruments-datasheet-27379352.pdf?src-supplier=Newark
J1 = header-5-103635-1: Conn Shrouded Header (4 Sides) HDR 2 POS 2.54mm Solder RA Thru-Hole Box/Tube; Manufacturer: TE Connectivity; Contact Resistance: 15mR; Current Rating: 3A; Connector Type: Plug; Insulation Resistance: 5GR; Number of Positions: 2; Backwall/Post Interruptions: No (Without); Contact Retention: Yes (With); Plating Thickness: 2.54um; Row Spacing: 0.1inch; Tail Length: 3.3mm; Approvals: CSA; Supplier 1: Mouser; Supplier Part Number 1: 571-5-103635-1; Manufacturer Part Number: 5-103635-1; Stock 1: 6279; Pricing 1: 1 = 0.82000, 10 = 0.68600, 100 = 0.60100, 500 = 0.53300, 1000 = 0.49000, 2500 = 0.43900, 10000 = 0.41200, 25000 = 0.39200 (USD); Mount: Through Hole; Contact Plating: Gold; Contact Material: Brass; Color: Black; Housing Color: Black; Housing Material: Thermoplastic; Contact Shape: Square; Min Operating Temperature: -65°C; Max Operating Temperature: 105°C; Packaging: Rail/Tube; Number of Rows: 1; Contact Gender: Male; Package Quantity: 70; Termination: Crimp; Number of Contacts: 2; Orientation: Right Angle; Mating Alignment: Yes (With); Mating Retention: Yes (With); PCB Mount Alignment: No (Without); Strain Relief: No (Without); Contact Current Rating: 3A; Length: 7.62mm; Height: 13.59mm; Lead Pitch: 2.54mm; Pitch: 2.54mm; Contact Mating Length: 0.23inch; Depth: 13.59mm; REACH SVHC: No SVHC; Flammability Rating: UL94 V-0; ComponentLink1URL: https://datasheet.ciiva.com/16318/eng-ds-4-1773458-0-ampmodu-mte-interconnect-sys-0411-16318801.pdf?src-supplier=Future+Electronics; ComponentLink1Description: https://datasheet.ciiva.com/16318/eng-ds-4-1773458-0-ampmodu-mte-interconnect-sys-0411-16318801.pdf?src-supplier=Future+Electronics; ComponentLink2URL: https://datasheet.ciiva.com/19462/752780-19462242.pdf?src-supplier=Jameco; ComponentLink2Description: https://datasheet.ciiva.com/19462/752780-19462242.pdf?src-supplier=Jameco; ComponentLink3URL: https://datasheet.ciiva.com/30493/0900766b80f9a68a-30493082.pdf?src-supplier=RSComponents; ComponentLink3Description: https://datasheet.ciiva.com/30493/0900766b80f9a68a-30493082.pdf?src-supplier=RSComponents; ComponentLink4URL: https://datasheet.ciiva.com/6045/1480701-6045513.pdf?src-supplier=Farnell; ComponentLink4Description: https://datasheet.ciiva.com/6045/1480701-6045513.pdf?src-supplier=Farnell; ComponentLink5URL: https://datasheet.ciiva.com/16657/eng-cs-1307819-section-5-cont-0808-16657957.pdf?src-supplier=Avnet+Europe; ComponentLink5Description: https://datasheet.ciiva.com/16657/eng-cs-1307819-section-5-cont-0808-16657957.pdf?src-supplier=Avnet+Europe; ComponentLink6URL: https://datasheet.ciiva.com/709/eng-cd-103635-s2-709865.pdf?src-supplier=Digi-Key; ComponentLink6Description: https://datasheet.ciiva.com/709/eng-cd-103635-s2-709865.pdf?src-supplier=Digi-Key; ComponentLink7URL: https://datasheet.ciiva.com/14641/70086824-14641690.pdf?src-supplier=Allied+Electronics; ComponentLink7Description: https://datasheet.ciiva.com/14641/70086824-14641690.pdf?src-supplier=Allied+Electronics; ComponentLink8URL: http://datasheet.octopart.com/5-103635-1-TE-Connectivity-datasheet-11077636.pdf?src-supplier=Newark; ComponentLink8Description: http://datasheet.octopart.com/5-103635-1-TE-Connectivity-datasheet-11077636.pdf?src-supplier=Newark; ComponentLink9URL: http://datasheet.octopart.com/5-103635-1-TE-Connectivity-datasheet-136861139.pdf?src-supplier=ShanghaiCT; ComponentLink9Description: http://datasheet.octopart.com/5-103635-1-TE-Connectivity-datasheet-136861139.pdf?src-supplier=ShanghaiCT; ComponentLink10URL: http://datasheet.octopart.com/5-103635-1-TE-Connectivity-datasheet-8324834.pdf?src-supplier=Master+Electronics; ComponentLink10Description: http://datasheet.octopart.com/5-103635-1-TE-Connectivity-datasheet-8324834.pdf?src-supplier=Master+Electronics; ComponentLink11URL: http://sigma.octopart.com/15108146/technical_drawing/TE-Connectivity-5-103635-1.pdf?src-supplier=TE+Connectivity; ComponentLink11Description: http://sigma.octopart.com/15108146/technical_drawing/TE-Connectivity-5-103635-1.pdf?src-supplier=TE+Connectivity; ComponentLink12URL: http://sigma.octopart.com/101748647/technical_drawing/TE-Connectivity-5-103635-1.pdf?src-supplier=ShanghaiCT; ComponentLink12Description: http://sigma.octopart.com/101748647/technical_drawing/TE-Connectivity-5-103635-1.pdf?src-supplier=ShanghaiCT; ComponentLink13URL: http://datasheet.octopart.com/5-103635-1-Tyco-Electronics-datasheet-13560061.pdf?src-supplier=TE+Connectivity; ComponentLink13Description: http://datasheet.octopart.com/5-103635-1-Tyco-Electronics-datasheet-13560061.pdf?src-supplier=TE+Connectivity; ComponentLink14URL: http://sigma.octopart.com/67302833/technical_drawing/TE-Connectivity-5-103635-1.pdf?src-supplier=TE+Connectivity; ComponentLink14Description: http://sigma.octopart.com/67302833/technical_drawing/TE-Connectivity-5-103635-1.pdf?src-supplier=TE+Connectivity; ComponentLink15URL: http://datasheet.octopart.com/5-103635-1-Tyco-Electronics-datasheet-8817613.pdf?src-supplier=Sager+Electronics; ComponentLink15Description: http://datasheet.octopart.com/5-103635-1-Tyco-Electronics-datasheet-8817613.pdf?src-supplier=Sager+Electronics; ComponentLink16URL: http://datasheet.octopart.com/5-103635-1-TE-Connectivity---AMP-datasheet-27832635.pdf?src-supplier=Farnell; ComponentLink16Description: http://datasheet.octopart.com/5-103635-1-TE-Connectivity---AMP-datasheet-27832635.pdf?src-supplier=Farnell; ComponentLink17URL: http://datasheet.octopart.com/5-103635-1-TE-Connectivity-datasheet-22147912.pdf?src-supplier=Allied+Electronics; ComponentLink17Description: http://datasheet.octopart.com/5-103635-1-TE-Connectivity-datasheet-22147912.pdf?src-supplier=Allied+Electronics; ComponentLink18URL: http://datasheet.octopart.com/5-103635-1-TE-Connectivity-datasheet-8318492.pdf?src-supplier=Jameco; ComponentLink18Description: http://datasheet.octopart.com/5-103635-1-TE-Connectivity-datasheet-8318492.pdf?src-supplier=Jameco; ComponentLink19URL: http://datasheet.octopart.com/5-103635-1-Tyco-Electronics-datasheet-508243.pdf?src-supplier=Future+Electronics; ComponentLink19Description: http://datasheet.octopart.com/5-103635-1-Tyco-Electronics-datasheet-508243.pdf?src-supplier=Future+Electronics; ComponentLink20URL: http://datasheet.octopart.com/5-103635-1-Tyco-Electronics-datasheet-8817976.pdf?src-supplier=Farnell; ComponentLink20Description: http://datasheet.octopart.com/5-103635-1-Tyco-Electronics-datasheet-8817976.pdf?src-supplier=Farnell; ComponentLink21URL: http://datasheet.octopart.com/5-103635-1-Tyco-Electronics-datasheet-9876728.pdf?src-supplier=Allied+Electronics; ComponentLink21Description: http://datasheet.octopart.com/5-103635-1-Tyco-Electronics-datasheet-9876728.pdf?src-supplier=Allied+Electronics; ComponentLink22URL: http://datasheet.octopart.com/5-103635-1-Tyco-Electronics-datasheet-13560509.pdf?src-supplier=Farnell; ComponentLink22Description: http://datasheet.octopart.com/5-103635-1-Tyco-Electronics-datasheet-13560509.pdf?src-supplier=Farnell